# EAGLE schematic Battery levelling (EAGLE 9.6.2)
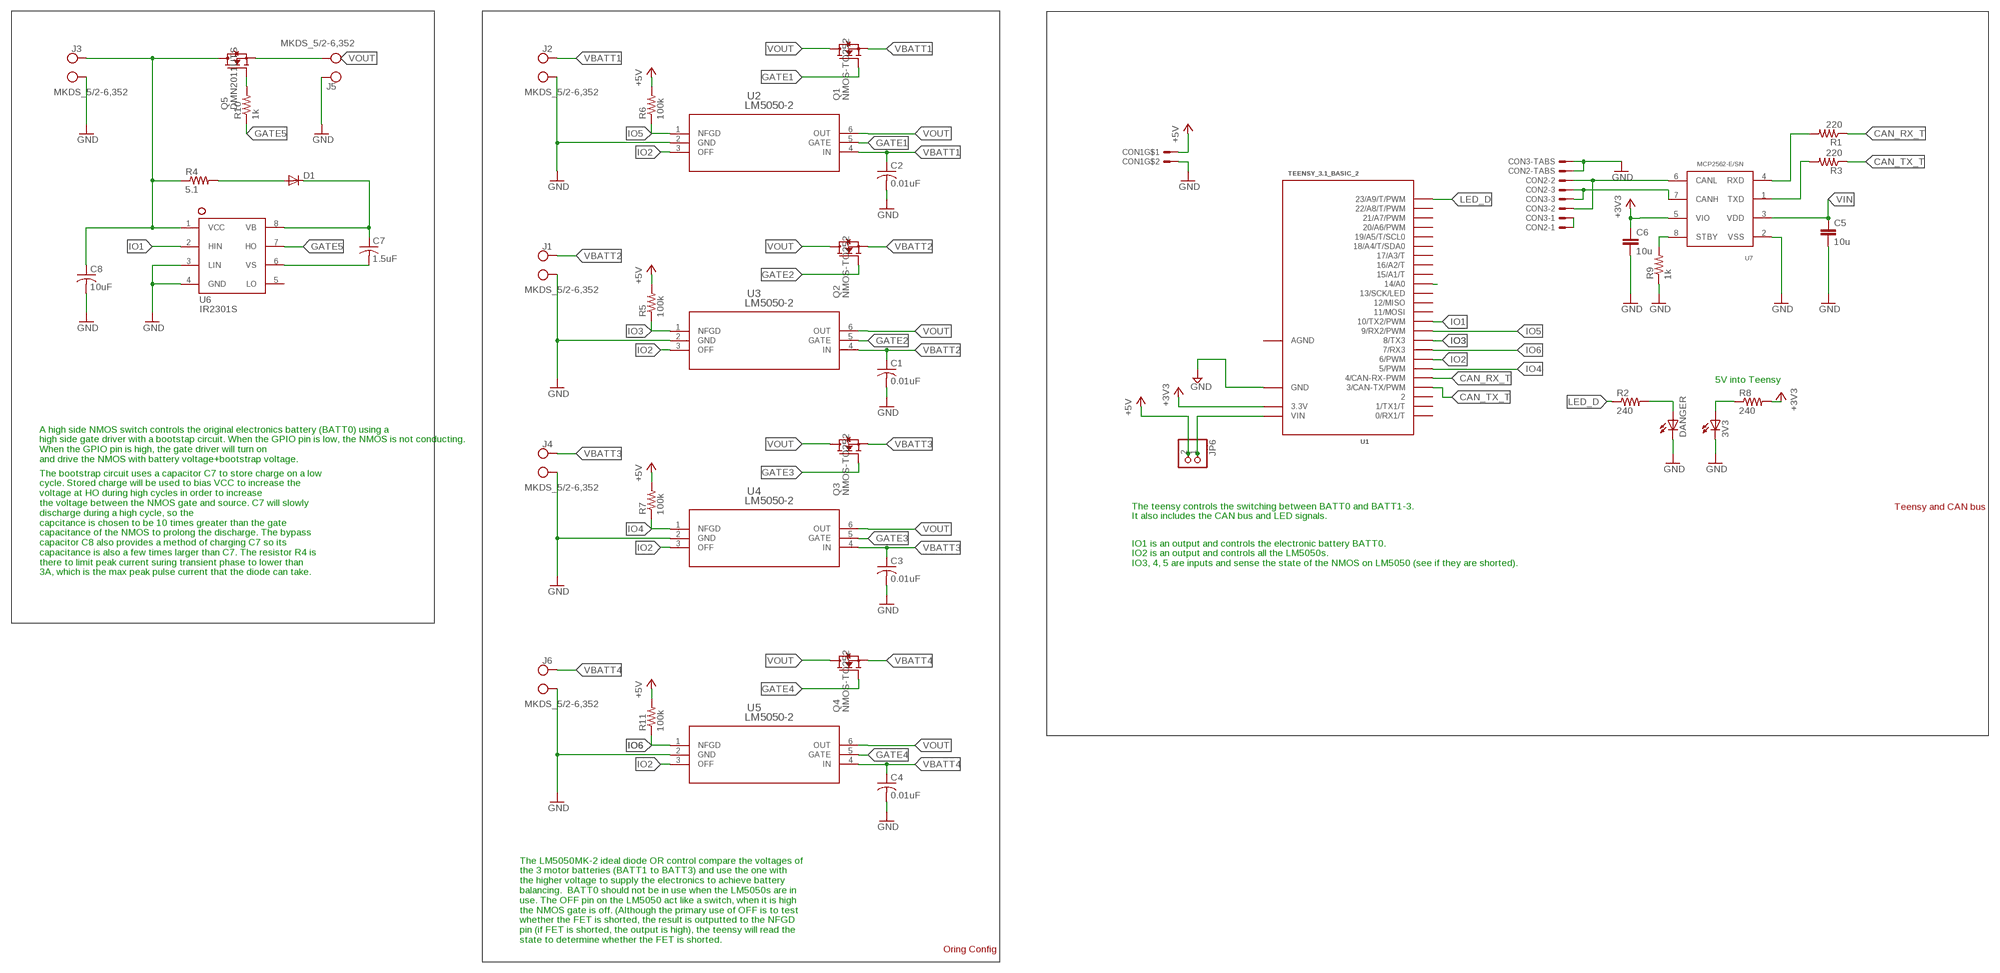
[diagram p0: schematic, sheet 1]

## Parts
3V3  LEDSMT1206  [1206]
C1  0.01uF  C-USC0805  [C0805]
C2  0.01uF  C-USC0805  [C0805]
C3  0.01uF  C-USC0805  [C0805]
C4  0.01uF  C-USC0805  [C0805]
C5  10u  C-EUC0805  [C0805]
C6  10u  C-EUC0805  [C0805]
C7  1.5uF  C-USC0805  [C0805]
C8  10uF  C-USC1206  [C1206]
CON1  MOLEX_5566-2  [5566-2]
CON2  SM03B-GHS-TB  [SM03B-GHS-TB]
CON3  SM03B-GHS-TB  [SM03B-GHS-TB]
D1  DIODE-DO-214AC  [DO-214AC]
DANGER  LEDSMT1206  [1206]
J1  MKDS_5/2-6,352  [MKDS_5/2-6,35]
J2  MKDS_5/2-6,352  [MKDS_5/2-6,35]
J3  MKDS_5/2-6,352  [MKDS_5/2-6,35]
J4  MKDS_5/2-6,352  [MKDS_5/2-6,35]
J5  MKDS_5/2-6,352  [MKDS_5/2-6,35]
J6  MKDS_5/2-6,352  [MKDS_5/2-6,35]
JP6  PINHD-1X2  [1X02]
Q1  NMOS-TO252  [TO252]
Q2  NMOS-TO252  [TO252]
Q3  NMOS-TO252  [TO252]
Q4  NMOS-TO252  [TO252]
Q5  DMN2011UTS  [SOP65P640X120-8N]
R1  220  R-US_R0805  [R0805]
R2  240  R-US_R1206  [R1206]
R3  220  R-US_R0805  [R0805]
R4  5.1  R-US_R1206  [R1206]
R5  100k  R-US_R1206  [R1206]
R6  100k  R-US_R1206  [R1206]
R7  100k  R-US_R1206  [R1206]
R8  240  R-US_R1206  [R1206]
R9  1k  R-US_R0805  [R0805]
R10  1k  R-US_R0805  [R0805]
R11  100k  R-US_R1206  [R1206]
U1  TEENSY_3.1_BASIC_2  [TEENSY_3.1_BASIC_2]
U2  LM5050-2  [MK06A]
U3  LM5050-2  [MK06A]
U4  LM5050-2  [MK06A]
U5  LM5050-2  [MK06A]
U6  IR2301S  [SOIC8]
U7  MCP2562-E/SN  [SOIC8]

## Nets
+3V3: C6.1 R8.2 U1.3.3V U7.5(VIO)
+5V: CON1.1 R5.2 R6.2 R7.2 R11.2
+5V1: JP6.2
CAN_RX1: R1.2 U7.4(RXD)
CAN_RX_T: R1.1 U1.4(4/CAN-RX-PWM)
CAN_TX2: R3.2 U7.1(TXD)
CAN_TX_T: R3.1 U1.3(3/CAN-TX/PWM)
CANH1: CON2.P$3 CON3.P$3 U7.7(CANH)
CANL1: CON2.P$2 CON3.P$2 U7.6(CANL)
CANSH1: CON2.P$1 CON3.P$1
GATE1: Q1.1(G) U2.5(GATE)
GATE2: Q2.1(G) U3.5(GATE)
GATE3: Q3.1(G) U4.5(GATE)
GATE4: Q4.1(G) U5.5(GATE)
GATE5: R10.1 U6.7(HO)
GND: 3V3.C C1.2 C2.2 C3.2 C4.2 C5.2 C6.2 C8.2 CON1.2 CON2.P$4 CON2.P$5 CON3.P$4 CON3.P$5 DANGER.C J1.1(KL) J2.1(KL) J3.1(KL) J4.1(KL) J5.2(KL1) J6.1(KL) R9.1 U1.GND U2.2(GND) U3.2(GND) U4.2(GND) U5.2(GND) U6.3(LIN) U6.4(GND) U7.2(VSS)
IO1: U1.10(10/TX2/PWM) U6.2(HIN)
IO2: U1.6(6/PWM) U2.3(OFF) U3.3(OFF) U4.3(OFF) U5.3(OFF)
IO3: R5.1 U1.8(8/TX3) U3.1(NFGD)
IO4: R7.1 U1.5(5/PWM) U4.1(NFGD)
IO5: R6.1 U1.9(9/RX2/PWM) U2.1(NFGD)
IO6: R11.1 U1.7(7/RX3) U5.1(NFGD)
LEAK_IN: U1.14/A0
LED_D: R2.1 U1.23/A9(23/A9/T/PWM)
N$1: C8.1 J3.2(KL1) Q5.5(D) Q5.6(D) Q5.7(D) Q5.8(D) R4.1 U6.1(VCC)
N$2: DANGER.A R2.2
N$3: D1.A R4.2
N$4: C7.2 U6.6(VS)
N$5: C7.1 D1.C U6.8(VB)
N$7: Q5.4(G) R10.2
N$17: 3V3.A R8.1
STB1: R9.2 U7.8(STBY)
VBATT1: C2.1 J2.2(KL1) Q1.3(S) U2.4(IN)
VBATT2: C1.1 J1.2(KL1) Q2.3(S) U3.4(IN)
VBATT3: C3.1 J4.2(KL1) Q3.3(S) U4.4(IN)
VBATT4: C4.1 J6.2(KL1) Q4.3(S) U5.4(IN)
VIN: C5.1 U1.VIN U7.3(VDD)
VIN1: JP6.1
VOUT: J5.1(KL) Q1.2(D) Q2.2(D) Q3.2(D) Q4.2(D) Q5.1(S) Q5.2(S) Q5.3(S) U2.6(OUT) U3.6(OUT) U4.6(OUT) U5.6(OUT)
Unconnected: U1.0(0/RX1/T) U1.1(1/TX1/T) U1.2 U1.11(11/MOSI) U1.12(12/MISO) U1.13(13/SCK/LED) U1.15/A1(15/A1/T) U1.16/A2(16/A2/T) U1.17/A3(17/A3/T) U1.18/A4(18/A4/T/SDA0) U1.19/A5(19/A5/T/SCL0) U1.20/A6(20/A6/PWM) U1.21/A7(21/A7/PWM) U1.22/A8(22/A8/T/PWM) U6.5(LO)

## Notes on the sheet
- 5V into Teensy
- A high side NMOS switch controls the original electronics battery (BATT0) using a
  high side gate driver with a bootstap circuit. When the GPIO pin is low, the NMOS is not conducting. 
  When the GPIO pin is high, the gate driver will turn on
  and drive the NMOS with battery voltage+bootstrap voltage.
- Teensy and CAN bus
- The teensy controls the switching between BATT0 and BATT1-3.
  It also includes the CAN bus and LED signals.
- IO1 is an output and controls the electronic battery BATT0.
  IO2 is an output and controls all the LM5050s.
  IO3, 4, 5 are inputs and sense the state of the NMOS on LM5050 (see if they are shorted).
- The bootstrap circuit uses a capacitor C7 to store charge on a low 
  cycle. Stored charge will be used to bias VCC to increase the
  voltage at HO during high cycles in order to increase 
  the voltage between the NMOS gate and source. C7 will slowly 
  discharge during a high cycle, so the
  capcitance is chosen to be 10 times greater than the gate
  capacitance of the NMOS to prolong the discharge. The bypass
  capacitor C8 also provides a method of charging C7 so its
  capacitance is also a few times larger than C7. The resistor R4 is
  there to limit peak current suring transient phase to lower than
  3A, which is the max peak pulse current that the diode can take.
- The LM5050MK-2 ideal diode OR control compare the voltages of
  the 3 motor batteries (BATT1 to BATT3) and use the one with
  the higher voltage to supply the electronics to achieve battery
  balancing.  BATT0 should not be in use when the LM5050s are in
  use. The OFF pin on the LM5050 act like a switch, when it is high
  the NMOS gate is off. (Although the primary use of OFF is to test
  whether the FET is shorted, the result is outputted to the NFGD
  pin (if FET is shorted, the output is high), the teensy will read the
  state to determine whether the FET is shorted.
- Oring Config

## Power pins joined to a net without a drawn wire
AGND: U1.AGND

## Library data of the parts
3V3 DANGER = adafruit:LED: LED OSRAM: - CHIPLED LG R971, LG N971, LY N971, LG Q971, LY Q971, LO R971, LY R971 LH N974, LH R974 LS Q976, LO Q976, LY Q976 LO Q996 - Hyper CHIPLED LW Q18S LB Q993, LB Q99A, LB R99A - SideLED LS A670, LO A670, LY A670, LG A670, LP A670 LB A673, LV A673, LT A673, LW A673 LH A674 LY A675 LS A676, LA A676, LO A676, LY A676, LW A676 LS A679, LY A679, LG A679 - Hyper Micro SIDELED® LS Y876, LA Y876, LO Y876, LY Y876 LT Y87S - SmartLED LW L88C, LW L88S LB L89C, LB L89S, LG L890 LS L89K, LO L89K, LY L89K LS L896, LA L896, LO L896, LY L896 - TOPLED LS T670, LO T670, LY T670, LG T670, LP T670 LSG T670, LSP T670, LSY T670, LOP T670, LYG T670 LG T671, LOG T671, LSG T671 LB T673, LV T673, LT T673, LW T673 LH T674 LS T676, LA T676, LO T676, LY T676, LB T676, LH T676, LSB T676, LW T676 LB T67C, LV T67C, LT T67C, LS T67K, LO T67K, LY T67K, LW E67C LS E67B, LA E67B, LO E67B, LY E67B, LB E67C, LV E67C, LT E67C LW T67C LS T679, LY T679, LG T679 LS T770, LO T770, LY T770, LG T770, LP T770 LB T773, LV T773, LT T773, LW T773 LH T774 LS E675, LA E675, LY E675, LS T675 LS T776, LA T776, LO T776, LY T776, LB T776 LHGB T686 LT T68C, LB T68C - Hyper Mini TOPLED® LB M676 - Mini TOPLED Santana® LG M470 LS M47K, LO M47K, LY M47K Source: http://www.osram.convergy.de/
C1-C4 C7 C8 = adafruit:C-US: CAPACITOR, American symbol
C5 C6 = rcl:C-EU: CAPACITOR, European symbol
CON1 = ARVP:MOLEX_5566-2
CON2 CON3 = ARVP:SM03B-GHS-TB
D1 = diode:DIODE-: DIODE
J1-J6 = Moira:MKDS_5/2-6,35: CONN TERM BLOCK 2POS 6.35MM PCB, 2 Position Wire to Board Terminal Block Horizontal with Board 0.250" (6.35mm) Through Hole, Phoenix Contact (1714955), Digikey:277-1269-ND, MKDS 5/2-6,35 package adpated from Eagle library package MKDS 5/3-6,35
JP6 = pinhead:PINHD-1X2: PIN HEADER
Q1-Q4 = AlbertaSat:NMOS-TO252
Q5 = Lydia:DMN2011UTS: MOSFET N-CH 20V 21A 8-TSSOP 20V 21A (Tc) 1.3W (Ta)
R1 R3 R9 R10 = rcl:R-US_: RESISTOR, American symbol
R2 R8 = resistor:R-US_: RESISTOR, American symbol
R4-R7 R11 = adafruit:R-US_: RESISTOR, American symbol
U1 = Teensy_3_Series_Board_v1.0:TEENSY_3.1_BASIC_2: Footprint for Teensy 3.1 board using all pin connections on the outer perimeter
U2-U5 = AlbertaSat:LM5050-2
U6 = Lydia:IR2301S
U7 = Lydia:MCP2562-E/SN